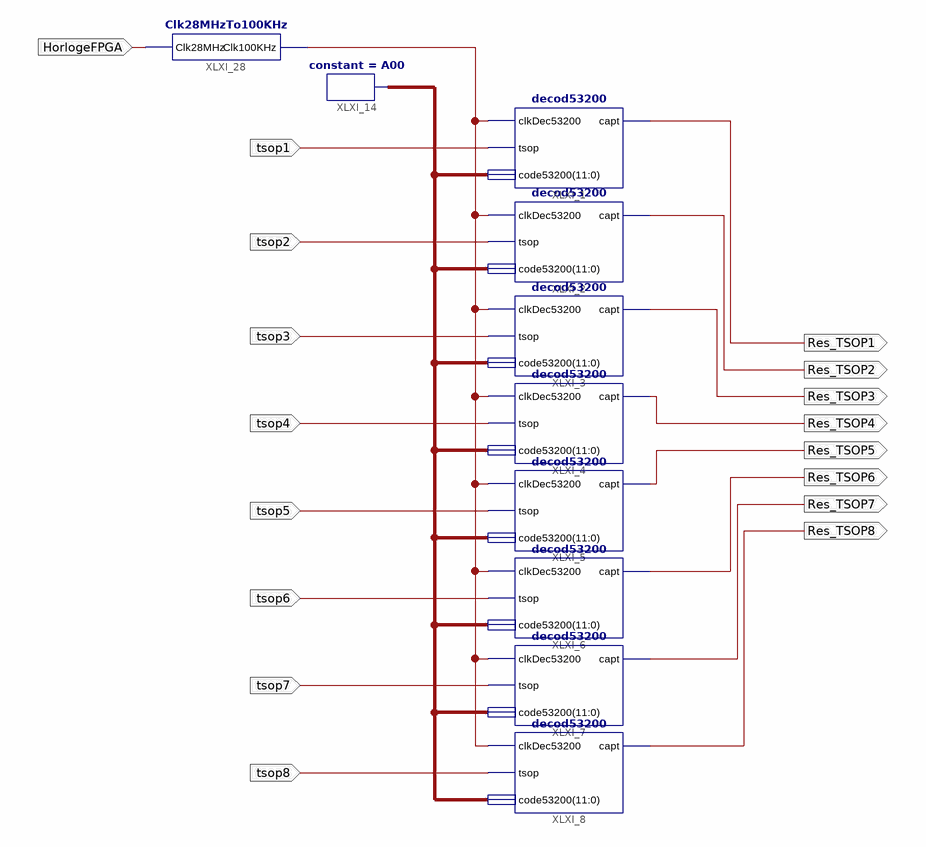
[diagram p0: schematic sheet 1]
// Xilinx ISE schematic tsop_8.sch (spartan3a) as structural Verilog: 10 symbols, 17 ports
module tsop_8 (
  input  tsop1,
  input  tsop2,
  input  tsop3,
  input  tsop4,
  input  tsop5,
  input  tsop6,
  input  tsop7,
  input  tsop8,
  input  HorlogeFPGA,
  output Res_TSOP1,
  output Res_TSOP2,
  output Res_TSOP3,
  output Res_TSOP6,
  output Res_TSOP7,
  output Res_TSOP8,
  output Res_TSOP4,
  output Res_TSOP5
);

  wire XLXN_7;
  wire [11:0] XLXN_27;

  decod53200 XLXI_2 (.clkDec53200(XLXN_7), .tsop(tsop2), .code53200(XLXN_27), .capt(Res_TSOP2));
  decod53200 XLXI_3 (.clkDec53200(XLXN_7), .tsop(tsop3), .code53200(XLXN_27), .capt(Res_TSOP3));
  decod53200 XLXI_4 (.clkDec53200(XLXN_7), .tsop(tsop4), .code53200(XLXN_27), .capt(Res_TSOP4));
  decod53200 XLXI_5 (.clkDec53200(XLXN_7), .tsop(tsop5), .code53200(XLXN_27), .capt(Res_TSOP5));
  decod53200 XLXI_6 (.clkDec53200(XLXN_7), .tsop(tsop6), .code53200(XLXN_27), .capt(Res_TSOP6));
  decod53200 XLXI_7 (.clkDec53200(XLXN_7), .tsop(tsop7), .code53200(XLXN_27), .capt(Res_TSOP7));
  decod53200 XLXI_8 (.clkDec53200(XLXN_7), .tsop(tsop8), .code53200(XLXN_27), .capt(Res_TSOP8));
  constant #(.CValue("A00")) XLXI_14 (.O(XLXN_27));
  decod53200 XLXI_1 (.clkDec53200(XLXN_7), .tsop(tsop1), .code53200(XLXN_27), .capt(Res_TSOP1));
  Clk28MHzTo100KHz XLXI_28 (.Clk28MHz(HorlogeFPGA), .Clk100KHz(XLXN_7));
endmodule
